# Altium schematic sheet nutnhanguyen ly A.SchDoc
size A3
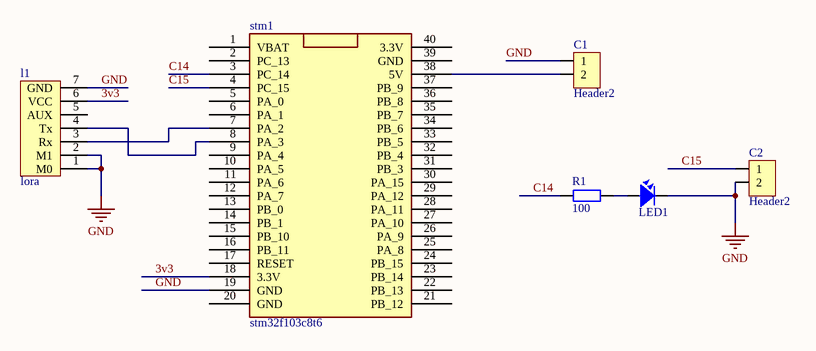
[diagram p0: nutnhanguyen ly A.SchDoc]

## Parts
C1  Header2  [Header2]
C2  Header2  [Header2]
l1  lora  [lora sx1278]
LED1  LED  [LED-5-RED]  (value not drawn)
R1  100  [R1/4W]
stm1  stm32f103c8t6  [40chan]

## Nets
GND: C1.1 C2.2 l1.1(M0) l1.2(M1) l1.7(GND) LED1.2 stm1.19(GND)
3v3: l1.6(VCC) stm1.18(3.3V)
C14: R1.1 stm1.3(PC_14)
C15: C2.1 stm1.4(PC_15)
NetC1_2: C1.2 stm1.38(5V)
Netl1_3: l1.3(Rx) stm1.7(PA_2)
Netl1_4: l1.4(Tx) stm1.8(PA_3)
NetLED1_1: LED1.1 R1.2

Not connected (* = marked no-connect by the designer): l1 5(AUX); stm1 1(VBAT) 2(PC_13) 5(PA_0) 6(PA_1) 9(PA_4) 10(PA_5) 11(PA_6) 12(PA_7) 13(PB_0) 14(PB_1) 15(PB_10) 16(PB_11) 17(RESET) 20(GND) 21(PB_12) 22(PB_13) 23(PB_14) 24(PB_15) 25(PA_8) 26(PA_9) 27(PA_10) 28(PA_11) 29(PA_12) 30(PA_15) 31(PB_3) 32(PB_4) 33(PB_5) 34(PB_6) 35(PB_7) 36(PB_8) 37(PB_9) 39(GND) 40(3.3V)

## Library data of the parts
C1 C2 = Header2: Header IDC, 2 x 1 Pin Vertical 2.54mm Pitch (Non-Boxed, Male); Manufacturer: W¨¹rth Elektronik eiSos GmbH; partNo: 613002143121; ComponentLink1 Description: Manufacturer; ComponentLink2 Description: Datasheet; NoPins: 02; Created Date: 29 March 2013; ComponentLink1URL: http://www.we-online.com; ComponentLink2URL: http://katalog.we-online.de/em/datasheet/6130xx143121.pdf; Created by: Karrer Zheng
l1 = lora SX1278
LED1 = LED: LED Single colour Green and Red; Value: LED 3 ly Single Colour
R1 = R1/4W: Resistor 1/4W; Value: R1/4W - 1K